# EAGLE schematic sentinel psionic sensor (EAGLE 9.2.0)
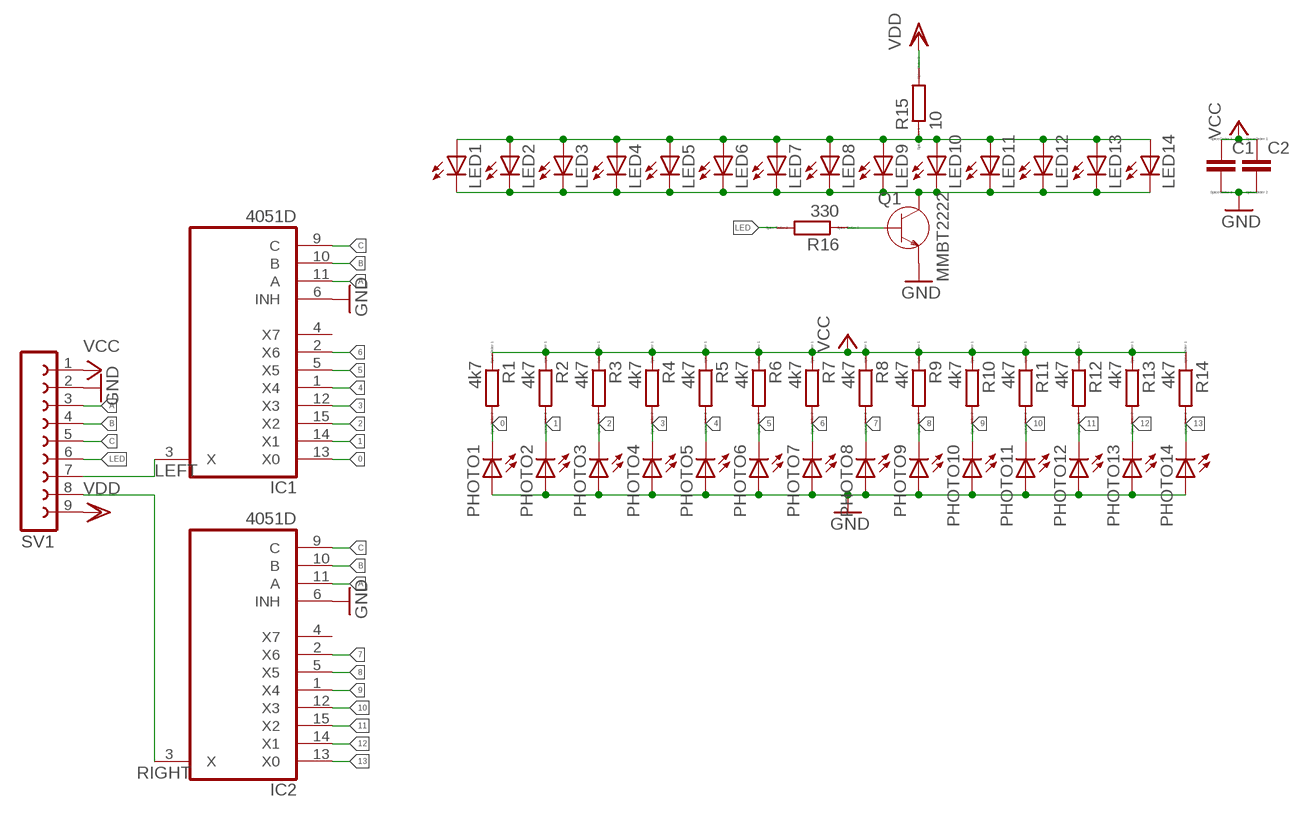
[diagram p0: schematic, sheet 1]

## Parts
C1  CC1206  [C1206]
C2  CC1206  [C1206]
IC1  4051D  [SO16]
IC2  4051D  [SO16]
LED1  LED3MM  [LED3MM]
LED2  LED3MM  [LED3MM]
LED3  LED3MM  [LED3MM]
LED4  LED3MM  [LED3MM]
LED5  LED3MM  [LED3MM]
LED6  LED3MM  [LED3MM]
LED7  LED3MM  [LED3MM]
LED8  LED3MM  [LED3MM]
LED9  LED3MM  [LED3MM]
LED10  LED3MM  [LED3MM]
LED11  LED3MM  [LED3MM]
LED12  LED3MM  [LED3MM]
LED13  LED3MM  [LED3MM]
LED14  LED3MM  [LED3MM]
PHOTO1  LED3MM  [LED3MM]
PHOTO2  LED3MM  [LED3MM]
PHOTO3  LED3MM  [LED3MM]
PHOTO4  LED3MM  [LED3MM]
PHOTO5  LED3MM  [LED3MM]
PHOTO6  LED3MM  [LED3MM]
PHOTO7  LED3MM  [LED3MM]
PHOTO8  LED3MM  [LED3MM]
PHOTO9  LED3MM  [LED3MM]
PHOTO10  LED3MM  [LED3MM]
PHOTO11  LED3MM  [LED3MM]
PHOTO12  LED3MM  [LED3MM]
PHOTO13  LED3MM  [LED3MM]
PHOTO14  LED3MM  [LED3MM]
Q1  MMBT2222  [SOT23]
R1  4k7  RR1206  [R1206]
R2  4k7  RR1206  [R1206]
R3  4k7  RR1206  [R1206]
R4  4k7  RR1206  [R1206]
R5  4k7  RR1206  [R1206]
R6  4k7  RR1206  [R1206]
R7  4k7  RR1206  [R1206]
R8  4k7  RR1206  [R1206]
R9  4k7  RR1206  [R1206]
R10  4k7  RR1206  [R1206]
R11  4k7  RR1206  [R1206]
R12  4k7  RR1206  [R1206]
R13  4k7  RR1206  [R1206]
R14  4k7  RR1206  [R1206]
R15  10  RR1206  [R1206]
R16  330  RR1206  [R1206]
SV1  FE09-1  [FE09]

## Nets
0: IC1.13(X0) PHOTO1.K(C) R1.2
1: IC1.14(X1) PHOTO2.K(C) R2.2
2: IC1.15(X2) PHOTO3.K(C) R3.2
3: IC1.12(X3) PHOTO4.K(C) R4.2
4: IC1.1(X4) PHOTO5.K(C) R5.2
5: IC1.5(X5) PHOTO6.K(C) R6.2
6: IC1.2(X6) PHOTO7.K(C) R7.2
7: IC2.2(X6) PHOTO8.K(C) R8.2
8: IC2.5(X5) PHOTO9.K(C) R9.2
9: IC2.1(X4) PHOTO10.K(C) R10.2
10: IC2.12(X3) PHOTO11.K(C) R11.2
11: IC2.15(X2) PHOTO12.K(C) R12.2
12: IC2.14(X1) PHOTO13.K(C) R13.2
13: IC2.13(X0) PHOTO14.K(C) R14.2
A: IC1.11(A) IC2.11(A) SV1.3
B: IC1.10(B) IC2.10(B) SV1.4
C: IC1.9(C) IC2.9(C) SV1.5
GND: C1.2 C2.2 IC1.6(INH) IC2.6(INH) PHOTO1.A PHOTO2.A PHOTO3.A PHOTO4.A PHOTO5.A PHOTO6.A PHOTO7.A PHOTO8.A PHOTO9.A PHOTO10.A PHOTO11.A PHOTO12.A PHOTO13.A PHOTO14.A Q1.2(E) SV1.2
LED: R16.2 SV1.6
LEFT: IC1.3(X) SV1.7
N$1: LED1.K(C) LED2.K(C) LED3.K(C) LED4.K(C) LED5.K(C) LED6.K(C) LED7.K(C) LED8.K(C) LED9.K(C) LED10.K(C) LED11.K(C) LED12.K(C) LED13.K(C) LED14.K(C) Q1.3(C)
N$2: LED1.A LED2.A LED3.A LED4.A LED5.A LED6.A LED7.A LED8.A LED9.A LED10.A LED11.A LED12.A LED13.A LED14.A R15.1
N$3: Q1.1(B) R16.1
RIGHT: IC2.3(X) SV1.8
VCC: C1.1 C2.1 R1.1 R2.1 R3.1 R4.1 R5.1 R6.1 R7.1 R8.1 R9.1 R10.1 R11.1 R12.1 R13.1 R14.1 SV1.1
VDD: R15.2 SV1.9
Unconnected: IC1.4(X7) IC2.4(X7)

## Power pins joined to a net without a drawn wire
GND: IC1.8(GND) IC2.8(GND)
VCC: IC1.16(VCC) IC2.16(VCC)
VEE: IC1.7(VEE) IC2.7(VEE)

## Library data of the parts
C1 C2 = eagle-ltspice:C: CAPACITOR, European symbol; SPICEMODEL: NONE; SPICEPREFIX: C
IC1 IC2 = 40xx:4051: 8-channel ANALOG MULTIPLEXER
LED1-LED14 PHOTO1-PHOTO14 = led:LED: LED OSRAM: - CHIPLED LG R971, LG N971, LY N971, LG Q971, LY Q971, LO R971, LY R971 LH N974, LH R974 LS Q976, LO Q976, LY Q976 LO Q996 - Hyper CHIPLED LW Q18S LB Q993, LB Q99A, LB R99A - SideLED LS A670, LO A670, LY A670, LG A670, LP A670 LB A673, LV A673, LT A673, LW A673 LH A674 LY A675 LS A676, LA A676, LO A676, LY A676, LW A676 LS A679, LY A679, LG A679 - Hyper Micro SIDELED® LS Y876, LA Y876, LO Y876, LY Y876 LT Y87S - SmartLED LW L88C, LW L88S LB L89C, LB L89S, LG L890 LS L89K, LO L89K, LY L89K LS L896, LA L896, LO L896, LY L896 - TOPLED LS T670, LO T670, LY T670, LG T670, LP T670 LSG T670, LSP T670, LSY T670, LOP T670, LYG T670 LG T671, LOG T671, LSG T671 LB T673, LV T673, LT T673, LW T673 LH T674 LS T676, LA T676, LO T676, LY T676, LB T676, LH T676, LSB T676, LW T676 LB T67C, LV T67C, LT T67C, LS T67K, LO T67K, LY T67K, LW E67C LS E67B, LA E67B, LO E67B, LY E67B, LB E67C, LV E67C, LT E67C LW T67C LS T679, LY T679, LG T679 LS T770, LO T770, LY T770, LG T770, LP T770 LB T773, LV T773, LT T773, LW T773 LH T774 LS E675, LA E675, LY E675, LS T675 LS T776, LA T776, LO T776, LY T776, LB T776 LHGB T686 LT T68C, LB T68C - Hyper Mini TOPLED® LB M676 - Mini TOPLED Santana® LG M470 LS M47K, LO M47K, LY M47K Source: http://www.osram.convergy.de LUXEON: - LUMILED® LXK2-PW12-R00, LXK2-PW12-S00, LXK2-PW14-U00, LXK2-PW14-V00 LXK2-PM12-R00, LXK2-PM12-S00, LXK2-PM14-U00 LXK2-PE12-Q00, LXK2-PE12-R00, LXK2-PE12-S00, LXK2-PE14-T00, LXK2-PE14-U00 LXK2-PB12-K00, LXK2-PB12-L00, LXK2-PB12-M00, LXK2-PB14-N00, LXK2-PB14-P00, LXK2-PB14-Q00 LXK2-PR12-L00, LXK2-PR12-M00, LXK2-PR14-Q00, LXK2-PR14-R00 LXK2-PD12-Q00, LXK2-PD12-R00, LXK2-PD12-S00 LXK2-PH12-R00, LXK2-PH12-S00 LXK2-PL12-P00, LXK2-PL12-Q00, LXK2-PL12-R00 Source: www.luxeon.com KINGBRIGHT: KA-3528ASYC Source: www.kingbright.com
Q1 = semiconductor:MMBT2222: General Purpose Transistors, NPN Silicon Rating MMBT2222LT1G MMBT2222ALT1G Collector-Emitter Voltage (VCEO) 30 Vdc 40 Vdc Collector-Base Voltage (VCBO) 60 Vdc 75 Vdc Emitter-Base Voltage (VEBO) 5.0 Vdc 6.0 Vdc Collector Current Continuous (IC) 600 mAdc 1100 mAdc Collector Current Peak (ICM) 600 mAdc 1100 mAdc
R1-R16 = eagle-ltspice:R: RESISTOR, European symbol; SPICEMODEL: NONE; SPICEPREFIX: R
SV1 = con-lsta:FE09-1: FEMALE HEADER; OC_FARNELL: unknown; OC_NEWARK: unknown